# EAGLE design nano_bt_mx (EAGLE 9.5.0)
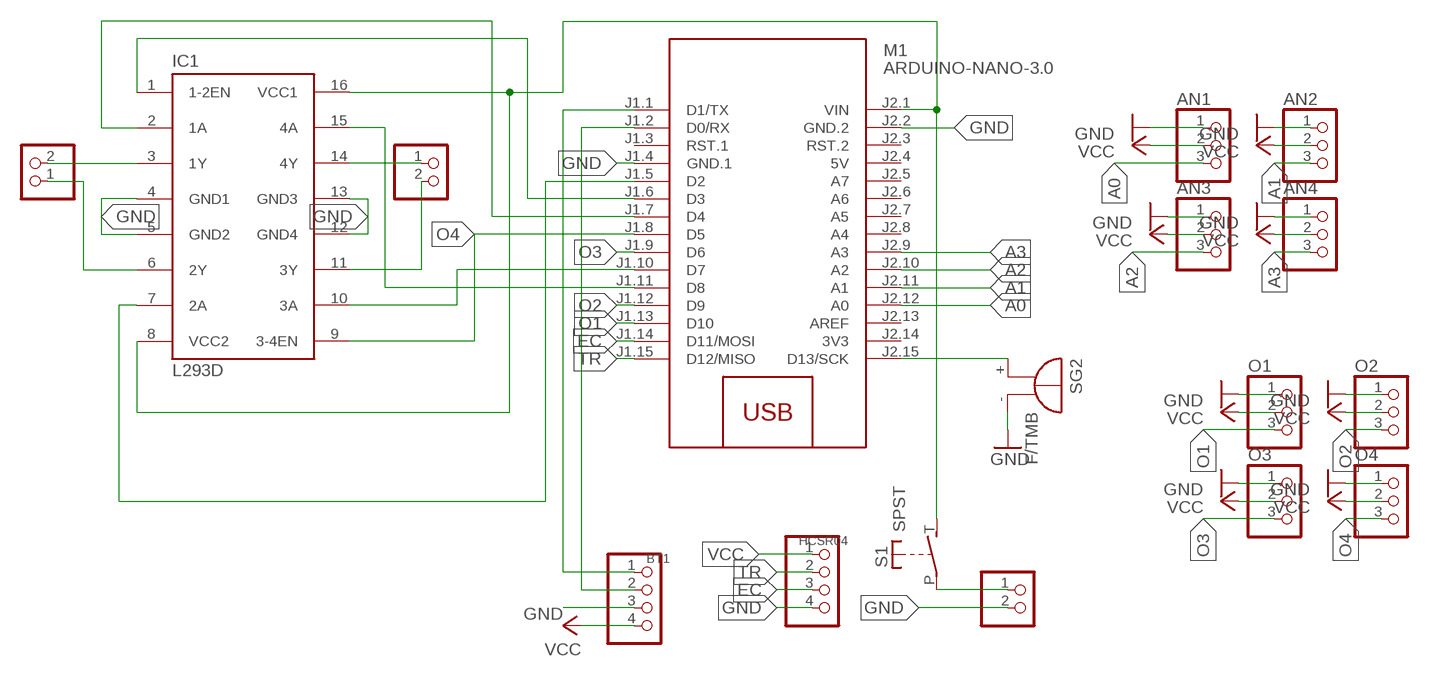
[diagram p0: schematic, sheet 1]

## Parts
AN1  PINHD-1X3  [1X03]
AN2  PINHD-1X3  [1X03]
AN3  PINHD-1X3  [1X03]
AN4  PINHD-1X3  [1X03]
BT1  PINHD-1X4  [1X04]
DCV  PINHD-1X2  [1X02]
HCSR04  PINHD-1X4  [1X04]
IC1  L293D  [DIL16]
M1  ARDUINO-NANO-3.0  [ARDUINO-NANO-3.0]
MT1  PINHD-1X2  [1X02]
MT2  PINHD-1X2  [1X02]
O1  PINHD-1X3  [1X03]
O2  PINHD-1X3  [1X03]
O3  PINHD-1X3  [1X03]
O4  PINHD-1X3  [1X03]
S1  SPST  [JUDCOSPST]
SG2  F/TMB  [F/TMB]

## Nets
A0: AN1.3 M1.J2.12(A0)
A1: AN2.3 M1.J2.11(A1)
A2: AN3.3 M1.J2.10(A2)
A3: AN4.3 M1.J2.9(A3)
EC: HCSR04.3 M1.J1.14(D11/MOSI)
GND: AN1.1 AN2.1 AN3.1 AN4.1 BT1.3 DCV.2 HCSR04.4 IC1.4(GND1) IC1.5(GND2) IC1.12(GND4) IC1.13(GND3) M1.J1.4(GND.1) M1.J2.2(GND.2) O1.1 O2.1 O3.1 O4.1 SG2.-
N$1: IC1.3(1Y) MT1.2
N$2: IC1.6(2Y) MT1.1
N$3: IC1.14(4Y) MT2.1
N$4: IC1.11(3Y) MT2.2
N$5: BT1.1 M1.J1.1(D1/TX)
N$6: BT1.2 M1.J1.2(D0/RX)
N$7: M1.J2.15(D13/SCK) SG2.+
N$8: IC1.8(VCC2) IC1.16(VCC1) M1.J2.1(VIN) S1.T(S)
N$9: IC1.7(2A) M1.J1.5(D2)
N$10: IC1.1(1-2EN) M1.J1.6(D3)
N$11: IC1.2(1A) M1.J1.7(D4)
N$12: DCV.1 S1.P
N$13: IC1.10(3A) M1.J1.10(D7)
N$14: IC1.15(4A) M1.J1.11(D8)
O1: M1.J1.13(D10) O1.3
O2: M1.J1.12(D9) O2.3
O3: M1.J1.9(D6) O3.3
O4: IC1.9(3-4EN) M1.J1.8(D5) O4.3
TR: HCSR04.2 M1.J1.15(D12/MISO)
VCC: AN1.2 AN2.2 AN3.2 AN4.2 BT1.4 HCSR04.1 O1.2 O2.2 O3.2 O4.2
Unconnected: M1.J1.3(RST.1) M1.J2.3(RST.2) M1.J2.5(A7) M1.J2.6(A6) M1.J2.7(A5) M1.J2.8(A4) M1.J2.13(AREF)

## Power pins joined to a net without a drawn wire
3V3: M1.J2.14(3V3)
5V: M1.J2.4(5V)

## Library data of the parts
AN1-AN4 O1-O4 = adafruit:PINHD-1X3: PIN HEADER
BT1 HCSR04 = pinhead:PINHD-1X4: PIN HEADER
DCV MT1 MT2 = pinhead:PINHD-1X2: PIN HEADER
IC1 = st-microelectronics:L293D: PUSH-PULL 4 CHANNEL DRIVER; MPN: L293D; OC_FARNELL: 9589619; OC_NEWARK: 56P8249
M1 = diy-modules:ARDUINO-NANO-3.0: Arduino Nano 3.0 and compatible devices More details available here: https://www.arduino.cc/en/Main/ArduinoBoardNano Click here to find device on ebay.com <http://www.ebay.com/sch/arduino+nano>
S1 = adafruit_arduino:SPST: Judco 50-0015-00
SG2 = buzzer:F/TMB: BUZZER Source: Buerklin; OC_FARNELL: unknown; OC_NEWARK: unknown

## Board
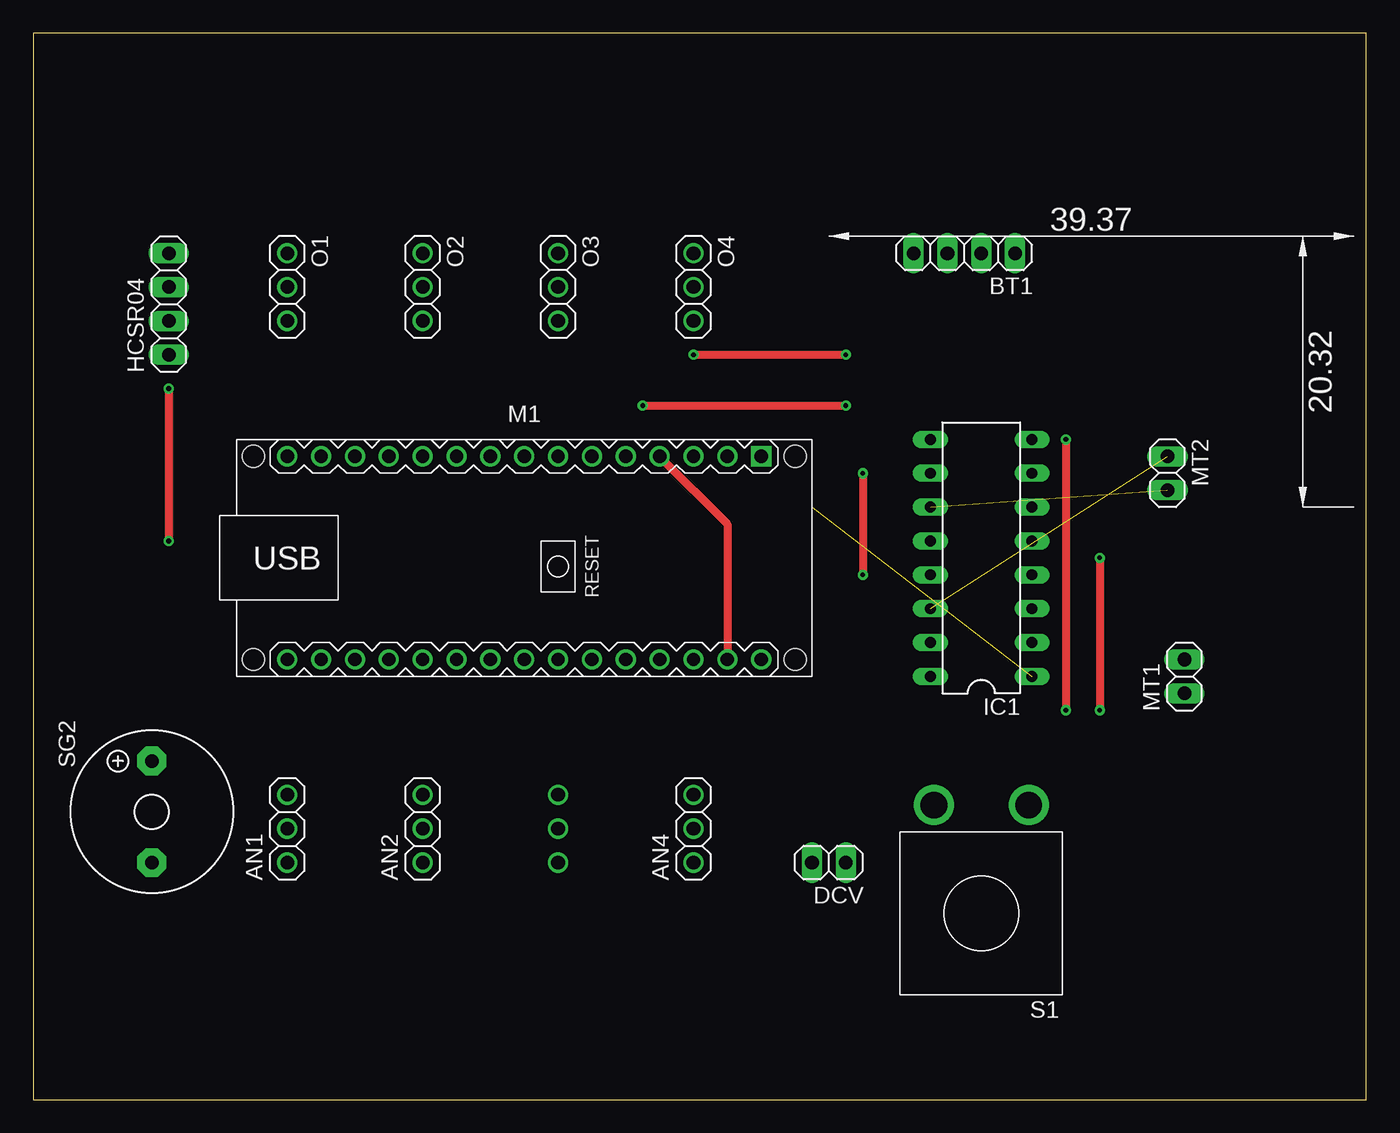
[diagram p1: board, top side]
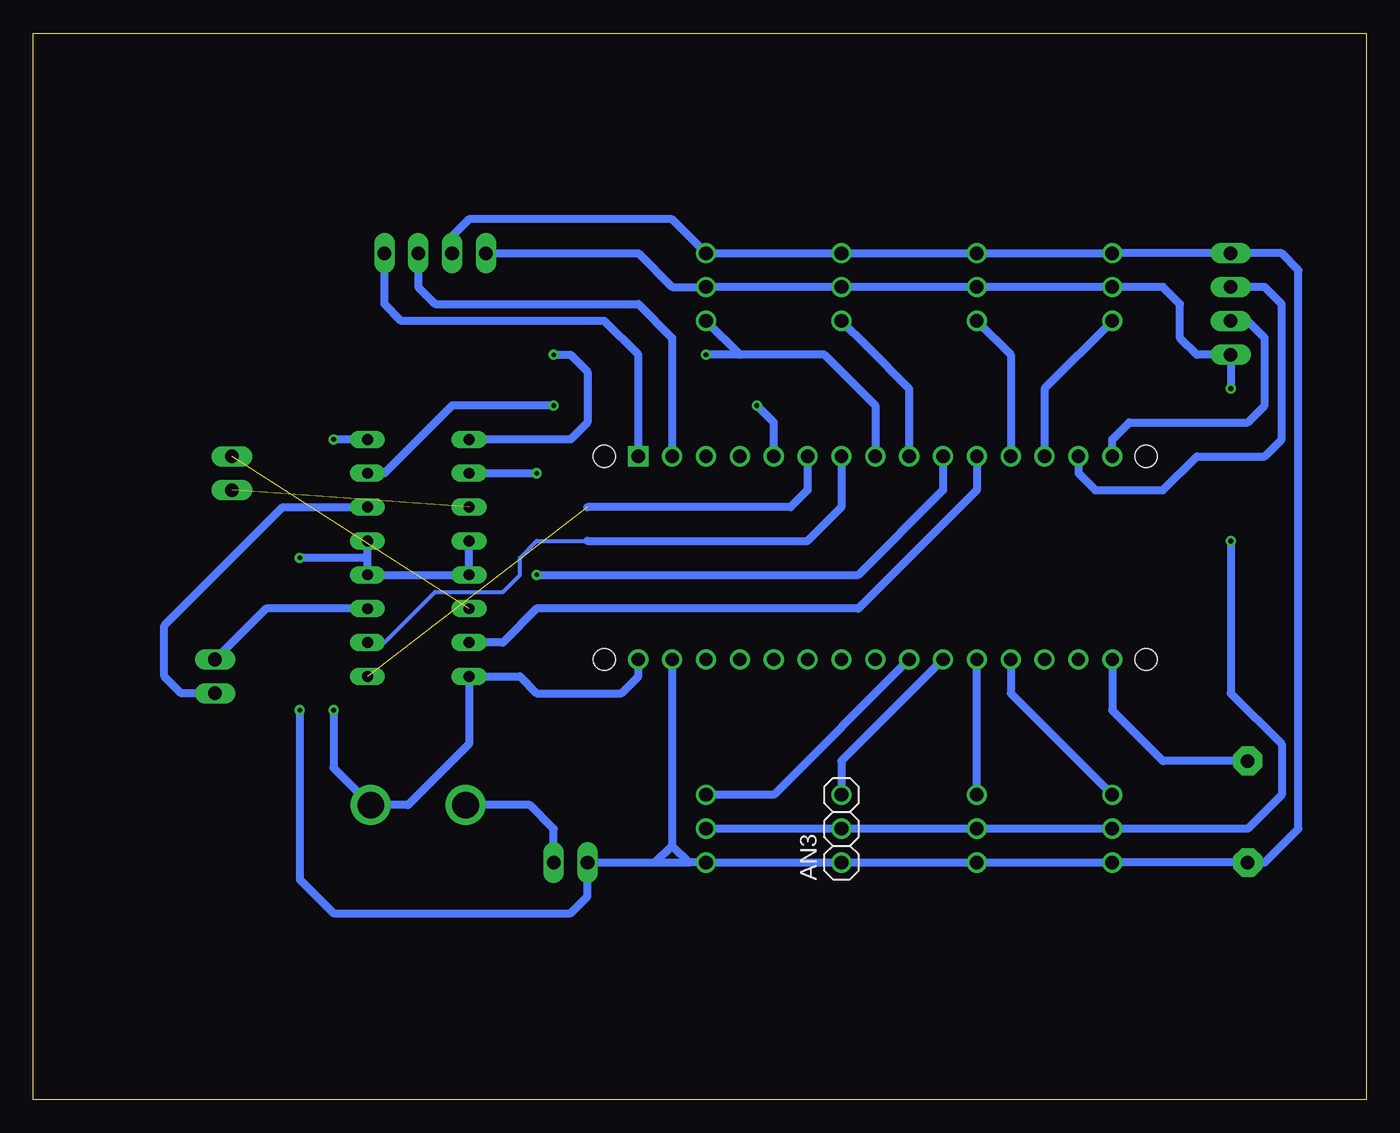
[diagram p2: board, bottom side, seen from below]

Size 100 x 80 mm. Coordinates in mm from the lower left corner, seen from the top.
Outline: 0,0 100,0 100,80 0,80 0,0
Copper layers (1*16): Top 0.035mm / dielectric 1.5mm / Bottom 0.035mm
Design rules "default": minimum track width 6mil, minimum drill 0.35mm, track to track 6mil, track to pad 6mil, pad to pad 6mil, via to via 6mil, smd to smd 6mil, copper to edge 40mil, drill to drill 6mil, minimum pad ring 10mil, minimum via ring 8mil, stop-mask expansion 4mil, vias tented up to drill 0mil, thermal gap 10mil

### Footprints (pad centres in the part's own frame; a part is rotated, then mirrored left to right if it is on the bottom)
1X03 = drill 1.016: 1 -2.54,0; 2 0,0; 3 2.54,0
1X04 = drill 1.016 long: 1 -3.81,0; 2 -1.27,0; 3 1.27,0; 4 3.81,0
1X02 = drill 1.016 long: 1 -1.27,0; 2 1.27,0
DIL16 = drill 0.813 long: 1 -8.89,-3.81; 2 -6.35,-3.81; 3 -3.81,-3.81; 4 -1.27,-3.81; 5 1.27,-3.81; 6 3.81,-3.81; 7 6.35,-3.81; 8 8.89,-3.81; 9 8.89,3.81; 10 6.35,3.81; 11 3.81,3.81; 12 1.27,3.81; 13 -1.27,3.81; 14 -3.81,3.81; 15 -6.35,3.81; 16 -8.89,3.81
ARDUINO-NANO-3.0 = drill 1 square: J1.1 17.78,7.62 | drill 1: J1.2 15.24,7.62; J1.3 12.7,7.62; J1.4 10.16,7.62; J1.5 7.62,7.62; J1.6 5.08,7.62; J1.7 2.54,7.62; J1.8 0,7.62; J1.9 -2.54,7.62; J1.10 -5.08,7.62; J1.11 -7.62,7.62; J1.12 -10.16,7.62; J1.13 -12.7,7.62; J1.14 -15.24,7.62; J1.15 -17.78,7.62; J2.1 17.78,-7.62; J2.2 15.24,-7.62; J2.3 12.7,-7.62; J2.4 10.16,-7.62; J2.5 7.62,-7.62; J2.6 5.08,-7.62; J2.7 2.54,-7.62; J2.8 0,-7.62; J2.9 -2.54,-7.62; J2.10 -5.08,-7.62; J2.11 -7.62,-7.62; J2.12 -10.16,-7.62; J2.13 -12.7,-7.62; J2.14 -15.24,-7.62; J2.15 -17.78,-7.62 | hole 1.651: -20.32,7.62; -20.32,-7.62; 20.32,-7.62; 20.32,7.62
JUDCOSPST = drill 2: P 3.556,-8.128; T -3.556,-8.128
F/TMB = drill 1.016 pad 2.159 octagon: + 3.81,0; - -3.81,0

### Placement (x,y rotation side)
AN1  19.05,20.32 90 top
AN2  29.21,20.32 90 top
AN3  39.37,20.32 90 bottom
AN4  49.53,20.32 90 top
BT1  69.85,63.5 180 top
DCV  59.69,17.78 180 top
HCSR04  10.16,59.69 90 top
IC1  71.12,40.64 90 top
M1  36.83,40.64 0 top
MT1  86.36,31.75 90 top
MT2  85.09,46.99 270 top
O1  19.05,60.96 270 top
O2  29.21,60.96 270 top
O3  39.37,60.96 270 top
O4  49.53,60.96 270 top
S1  71.12,13.97 180 top
SG2  8.89,21.59 90 top

### Tracks (layer width: path | path; a pad name or v marks a point on that pad's centre or on a via)
A0
  Bottom 0.61: M1.J2.12 26.67,30.48 AN1.3
A1
  Bottom 0.61: AN2.3 M1.J2.11
A2
  Bottom 0.61: M1.J2.10 39.37,25.4 AN3.3
A3
  Bottom 0.61: M1.J2.9 44.45,22.86 AN4.3
EC
  Bottom 0.61: M1.J1.14 21.59,46.99 20.32,45.72 15.24,45.72 12.7,48.26 7.62,48.26 6.35,49.53 6.35,59.69 7.62,60.96 HCSR04.3
GND  (via drill 0.35)
  Top 0.61: M1.J1.4 52.07,43.18 M1.J2.2 | v80.01,40.64 v80.01,29.21
  Bottom 0.61: 50.8,17.78 AN4.1 AN3.1 AN2.1 AN1.1 SG2.- 7.62,17.78 5.08,20.32 5.08,62.23 6.35,63.5 HCSR04.4 O1.1 O2.1 O3.1 O4.1 52.07,66.04 67.31,66.04 68.58,64.77 BT1.3 | M1.J2.2 52.07,19.05 | 50.8,17.78 52.07,19.05 | 53.34,17.78 DCV.2 58.42,15.24 59.69,13.97 77.47,13.97 80.01,16.51 v80.01,29.21 | 53.34,17.78 50.8,17.78 | 52.07,19.05 53.34,17.78 | 74.93,40.64 IC1.4 IC1.13 IC1.12 | 74.93,40.64 IC1.5 | 74.93,40.64 v80.01,40.64
N$1
  Bottom 0.61: IC1.3 82.55,36.83 MT1.2
N$2
  Bottom 0.61: MT1.1 88.9,30.48 90.17,31.75 90.17,35.56 81.28,44.45 IC1.6
N$3  (1 unrouted)
N$4  (1 unrouted)
N$5
  Bottom 0.61: BT1.1 73.66,59.69 72.39,58.42 57.15,58.42 54.61,55.88 M1.J1.1
N$6
  Bottom 0.61: BT1.2 71.12,60.96 69.85,59.69 54.61,59.69 52.07,57.15 M1.J1.2
N$7
  Bottom 0.61: M1.J2.15 19.05,29.21 15.24,25.4 SG2.+
N$8  (via drill 0.35)
  Top 0.61: v77.47,49.53 v77.47,29.21
  Bottom 0.61: M1.J2.1 54.61,31.75 55.88,30.48 62.23,30.48 63.5,31.75 IC1.16 67.31,26.67 71.88,22.1 S1.T 77.47,24.89 v77.47,29.21 | IC1.8 v77.47,49.53
N$9  (via drill 0.35)
  Top 0.61: v45.72,52.07 v60.96,52.07
  Bottom 0.61: M1.J1.5 44.45,50.8 v45.72,52.07 | v60.96,52.07 68.58,52.07 73.66,46.99 IC1.7
N$10  (1 unrouted)
  Bottom 0.61: M1.J1.6 41.91,45.72 43.18,44.45 58.42,44.45
N$11
  Bottom 0.305: IC1.2 73.66,34.29 69.85,38.1 64.77,38.1 63.5,39.37 63.5,40.64 62.23,41.91 58.42,41.91
  Bottom 0.61: M1.J1.7 39.37,44.45 41.91,41.91 58.42,41.91
N$12
  Bottom 0.61: DCV.1 60.96,20.32 62.74,22.1 S1.P
N$13  (via drill 0.35)
  Top 0.61: v62.23,46.99 v62.23,39.37
  Bottom 0.61: M1.J1.10 31.75,45.72 38.1,39.37 v62.23,39.37 | IC1.10 v62.23,46.99
N$14
  Bottom 0.61: M1.J1.11 29.21,45.72 38.1,36.83 62.23,36.83 64.77,34.29 IC1.15
O1
  Bottom 0.61: O1.3 24.13,53.34 M1.J1.13
O2
  Bottom 0.61: O2.3 26.67,55.88 M1.J1.12
O3
  Bottom 0.61: O3.3 37.47,56.52 34.29,53.34 M1.J1.9
O4  (via drill 0.35)
  Top 0.61: v49.53,55.88 v60.96,55.88
  Bottom 0.61: O4.3 46.99,55.88 | 46.99,55.88 40.64,55.88 36.83,52.07 M1.J1.8 | 46.99,55.88 v49.53,55.88 | v60.96,55.88 59.69,55.88 58.42,54.61 58.42,50.8 59.69,49.53 IC1.9
TR
  Bottom 0.61: M1.J1.15 19.05,49.53 17.78,50.8 8.89,50.8 7.62,52.07 7.62,57.15 8.89,58.42 HCSR04.2
VCC  (via drill 0.35)
  Top 0.61: v10.16,53.34 v10.16,41.91
  Bottom 0.61: AN4.2 AN3.2 AN2.2 AN1.2 8.89,20.32 6.35,22.86 6.35,26.67 10.16,30.48 v10.16,41.91 | v10.16,53.34 HCSR04.1 12.7,55.88 13.97,57.15 13.97,59.69 15.24,60.96 O1.2 O2.2 O3.2 O4.2 52.07,60.96 54.61,63.5 BT1.4